# EAGLE design SERVO UNIT (EAGLE 9.5.0)
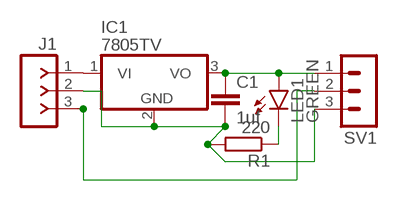
[diagram p0: schematic, sheet 1]

## Parts
C1  1uf  C-EU025-025X050  [C025-025X050]
IC1  7805TV  [TO220V]
J1  F-1X03-SIP-100-32Y  [SIP-100-03-32Y]
LED1  GREEN  LEDSML0805  [SML0805]
R1  220  R-EU_0204/7  [0204/7]
SV1  MA03-1  [MA03-1]

## Nets
N$1: IC1.1(VI) J1.1
N$3: C1.1 IC1.3(VO) LED1.A SV1.1
N$4: LED1.C R1.1
N$5: C1.2 IC1.2(GND) J1.2 R1.2 SV1.3
N$7: J1.3 SV1.2

## Library data of the parts
C1 = rcl:C-EU: CAPACITOR, European symbol; SPICEPREFIX: C
IC1 = linear:78*: Positive VOLTAGE REGULATOR Source: http://cache.national.com/ds/LM/LM78L05.pdf http://www.fairchildsemi.com/ds/LM/LM7805.pdf
J1 = con-headers-jp:F-1X03-: FEMALE HEADER
LED1 = led:LED: LED OSRAM: - CHIPLED LG R971, LG N971, LY N971, LG Q971, LY Q971, LO R971, LY R971 LH N974, LH R974 LS Q976, LO Q976, LY Q976 LO Q996 - Hyper CHIPLED LW Q18S LB Q993, LB Q99A, LB R99A - SideLED LS A670, LO A670, LY A670, LG A670, LP A670 LB A673, LV A673, LT A673, LW A673 LH A674 LY A675 LS A676, LA A676, LO A676, LY A676, LW A676 LS A679, LY A679, LG A679 - Hyper Micro SIDELED® LS Y876, LA Y876, LO Y876, LY Y876 LT Y87S - SmartLED LW L88C, LW L88S LB L89C, LB L89S, LG L890 LS L89K, LO L89K, LY L89K LS L896, LA L896, LO L896, LY L896 - TOPLED LS T670, LO T670, LY T670, LG T670, LP T670 LSG T670, LSP T670, LSY T670, LOP T670, LYG T670 LG T671, LOG T671, LSG T671 LB T673, LV T673, LT T673, LW T673 LH T674 LS T676, LA T676, LO T676, LY T676, LB T676, LH T676, LSB T676, LW T676 LB T67C, LV T67C, LT T67C, LS T67K, LO T67K, LY T67K, LW E67C LS E67B, LA E67B, LO E67B, LY E67B, LB E67C, LV E67C, LT E67C LW T67C LS T679, LY T679, LG T679 LS T770, LO T770, LY T770, LG T770, LP T770 LB T773, LV T773, LT T773, LW T773 LH T774 LS E675, LA E675, LY E675, LS T675 LS T776, LA T776, LO T776, LY T776, LB T776 LHGB T686 LT T68C, LB T68C - Hyper Mini TOPLED® LB M676 - Mini TOPLED Santana® LG M470 LS M47K, LO M47K, LY M47K Source: http://www.osram.convergy.de LUXEON: - LUMILED® LXK2-PW12-R00, LXK2-PW12-S00, LXK2-PW14-U00, LXK2-PW14-V00 LXK2-PM12-R00, LXK2-PM12-S00, LXK2-PM14-U00 LXK2-PE12-Q00, LXK2-PE12-R00, LXK2-PE12-S00, LXK2-PE14-T00, LXK2-PE14-U00 LXK2-PB12-K00, LXK2-PB12-L00, LXK2-PB12-M00, LXK2-PB14-N00, LXK2-PB14-P00, LXK2-PB14-Q00 LXK2-PR12-L00, LXK2-PR12-M00, LXK2-PR14-Q00, LXK2-PR14-R00 LXK2-PD12-Q00, LXK2-PD12-R00, LXK2-PD12-S00 LXK2-PH12-R00, LXK2-PH12-S00 LXK2-PL12-P00, LXK2-PL12-Q00, LXK2-PL12-R00 Source: www.luxeon.com KINGBRIGHT: KA-3528ASYC Source: www.kingbright.com
R1 = rcl:R-EU_: RESISTOR, European symbol; SPICEPREFIX: R
SV1 = con-lstb:MA03-1: PIN HEADER; OC_FARNELL: unknown; OC_NEWARK: unknown

## Board
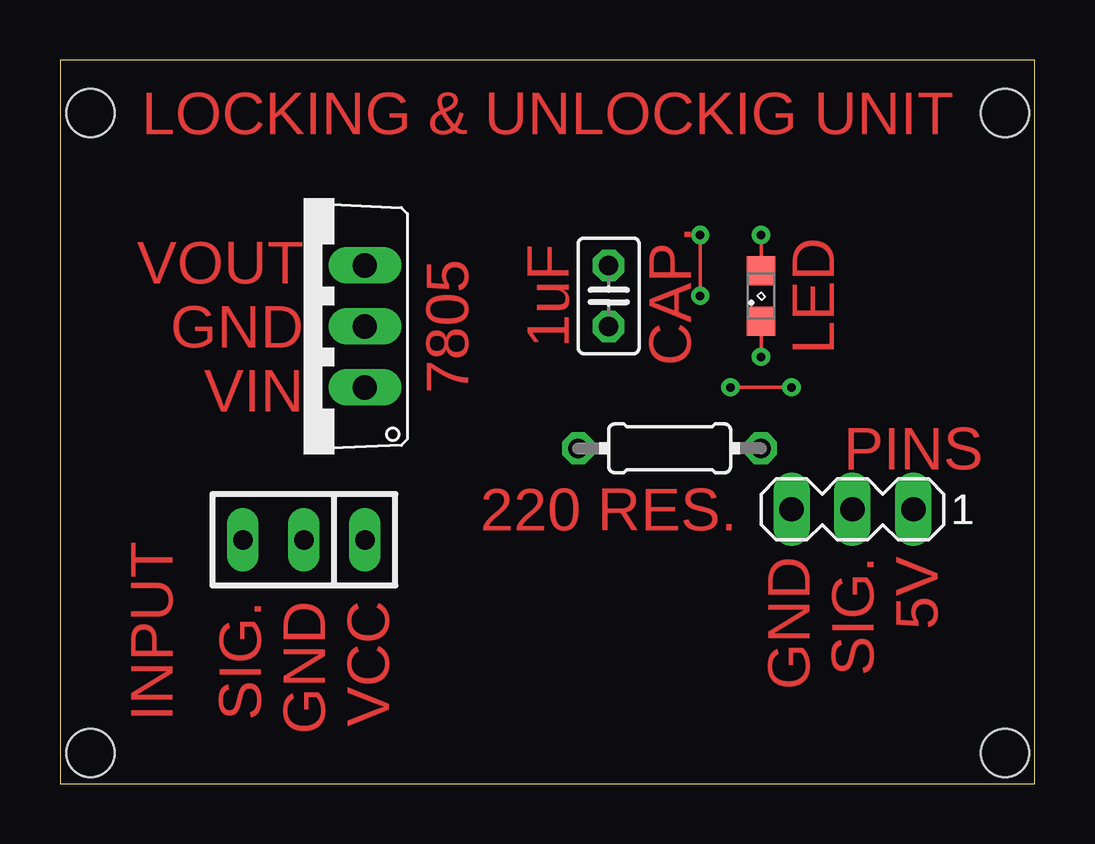
[diagram p1: board, top side]
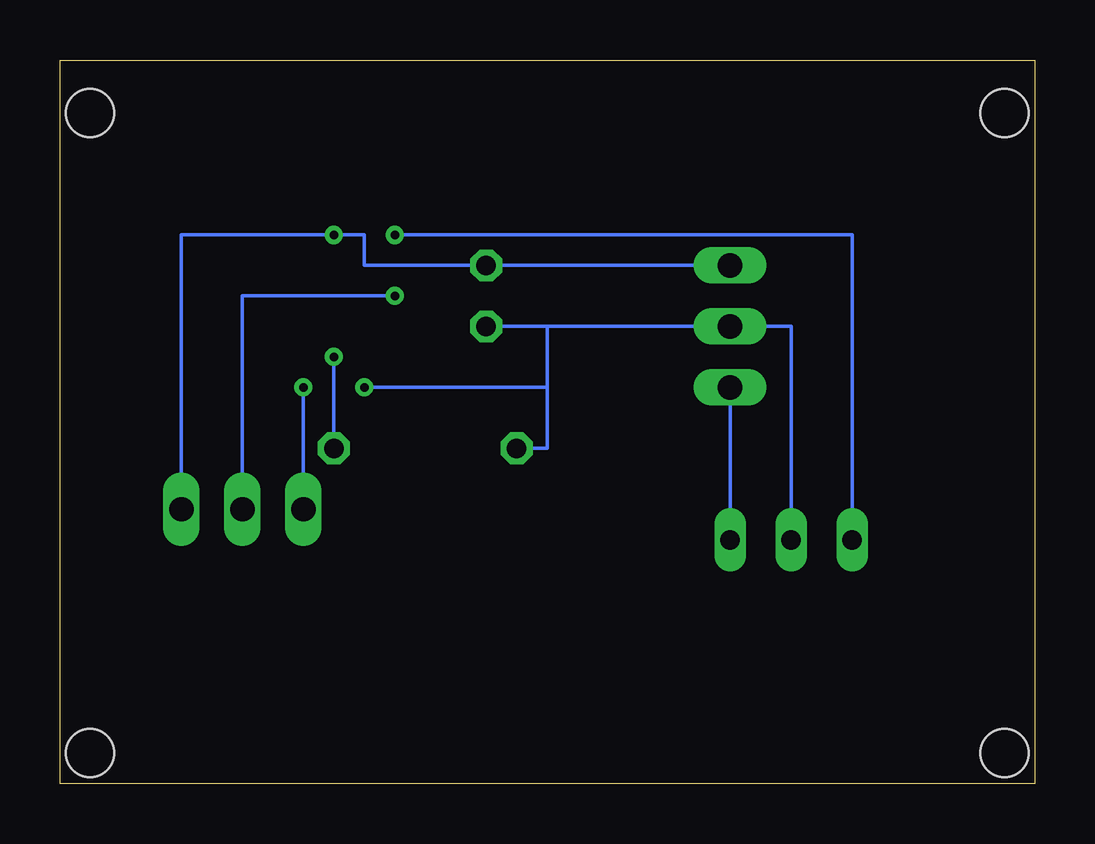
[diagram p2: board, bottom side, seen from below]

Size 40.62 x 30.15 mm. Coordinates in mm from the lower left corner, seen from the top.
Outline: 0,0 40.62,0 40.62,30.15 0,30.15 0,0
Copper layers (1*16): Top 0.035mm / dielectric 1.5mm / Bottom 0.035mm
Design rules "default": minimum track width 6mil, minimum drill 0.35mm, track to track 6mil, track to pad 6mil, pad to pad 6mil, via to via 6mil, smd to smd 6mil, copper to edge 40mil, drill to drill 6mil, minimum pad ring 10mil, minimum via ring 8mil, stop-mask expansion 4mil, vias tented up to drill 0mil, thermal gap 10mil
Holes 2 mm at 1.27,1.27 39.37,1.27 1.27,27.94 39.37,27.94

### Footprints (pad centres in the part's own frame; a part is rotated, then mirrored left to right if it is on the bottom)
C025-025X050 = drill 0.813 octagon: 1 -1.27,0; 2 1.27,0
TO220V = drill 1.016 long: 1 -2.54,-2.54; 2 0,-2.54; 3 2.54,-2.54
SIP-100-03-32Y = drill 0.813 long: 1 -2.54,0; 2 0,0; 3 2.54,0
SML0805 = smd 1.2 x 1.2: A 1.05,0; C -1.05,0
0204/7 = drill 0.813 octagon: 1 -3.81,0; 2 3.81,0
MA03-1 = drill 1.016 long: 1 -2.54,0; 2 0,0; 3 2.54,0

### Placement (x,y rotation side)
C1  22.86,20.32 270 top
IC1  10.16,19.05 90 top
J1  10.16,10.16 180 top
LED1  29.21,20.32 90 top
R1  25.4,13.97 180 top
SV1  33.02,11.43 180 top

### Tracks (layer width: path | path; a pad name or v marks a point on that pad's centre or on a via)
N$1
  Bottom 0.152: J1.1 IC1.1
N$3  (via drill 0.35)
  Top 0.152: LED1.A v29.21,22.86
  Bottom 0.152: IC1.3 C1.1 27.94,21.59 27.94,22.86 v29.21,22.86 35.56,22.86 SV1.1
N$4  (via drill 0.35)
  Top 0.152: LED1.C v29.21,17.78
  Bottom 0.152: R1.1 v29.21,17.78
N$5  (via drill 0.35)
  Top 0.152: v27.94,16.51 v30.48,16.51
  Bottom 0.152: 20.32,19.05 IC1.2 10.16,19.05 J1.2 | 20.32,19.05 C1.2 | R1.2 20.32,13.97 20.32,16.51 | 20.32,16.51 20.32,19.05 | 20.32,16.51 v27.94,16.51 | v30.48,16.51 SV1.3
N$7  (via drill 0.35)
  Top 0.152: v26.67,20.32 v26.67,22.86
  Bottom 0.152: v26.67,22.86 7.62,22.86 J1.3 | v26.67,20.32 33.02,20.32 SV1.2

### Text on the board
Top: LOCKING & UNLOCKIG UNIT | 1uF | CAP. | LED | VOUT / GND / VIN | 7805 | PINS | 220 RES. | GND / SIG. / 5V | SIG. / GND / VCC | INPUT